# Altium project SPE_router.PrjPcb (part 2 of 3)

## Sheet SPE_router_eth.SchDoc: SPE Router
size 420 x 297 mm; Author: P. Daniel; CompanyName: WUT ISE; DrawnBy: P. Daniel; Organization: WUT ISE; Address1: WUT ISE; Address2: Nowowiejska 15/19 00-665 Warsaw; Address3: piotrmaciejdaniel@gmail.com; Revision: 1; SheetNumber: 3; SheetTotal: 4; ModifiedBy: -; CreateDate: 02-03.2023; CheckedDate: -; Title2: ETH PHY; DivGrp: WUT ISE; Designer: Piotr Daniel
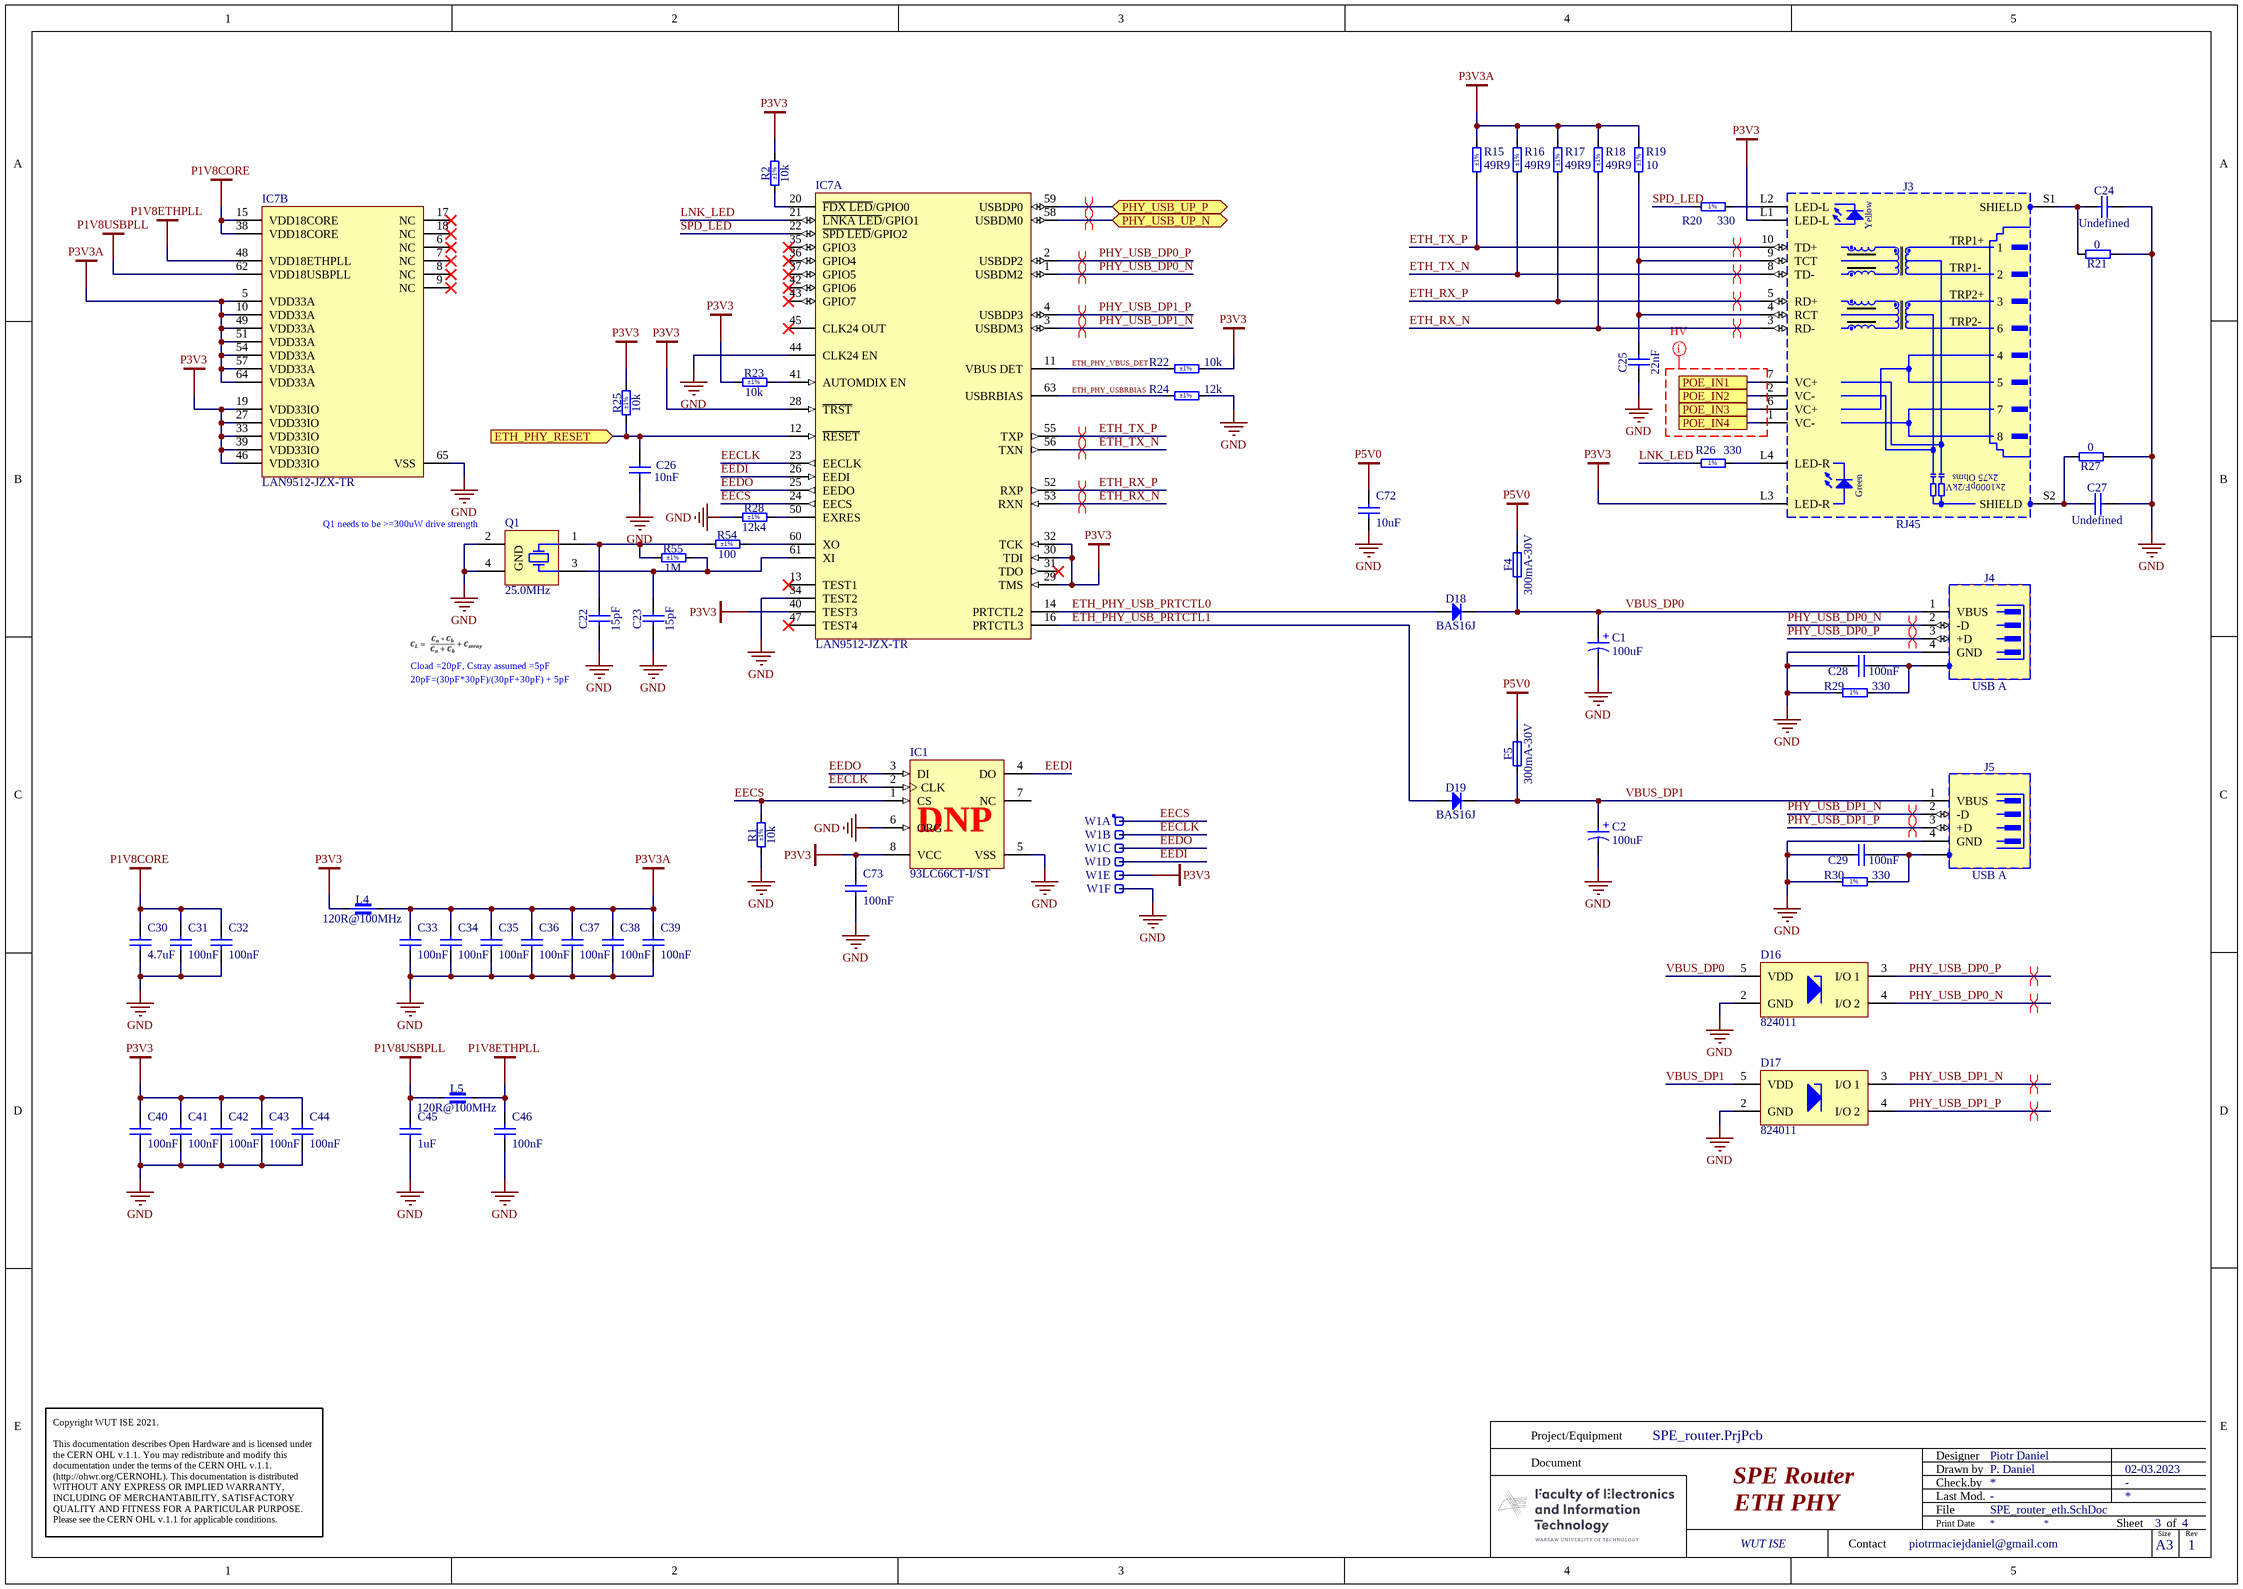
[diagram p2: SPE_router_eth.SchDoc]

### Parts
C1  100uF  [WCAP-ASLU_D5H5.5]
C2  100uF  [WCAP-ASLU_D5H5.5]
C22  15pF  [CAPC1005X55N]
C23  15pF  [CAPC1005X55N]
C24  Undefined  [CAPC2012X135N]
C25  22nF  [CAPC2012X145N]
C26  10nF  [CAPC1005X55N]
C27  Undefined  [CAPC2012X135N]
C28  100nF  [CAPC1005X55N]
C29  100nF  [CAPC1005X55N]
C30  4.7uF  [CAPC1709X95N]
C31  100nF  [CAPC1005X55N]
C32  100nF  [CAPC1005X55N]
C33  100nF  [CAPC1005X55N]
C34  100nF  [CAPC1005X55N]
C35  100nF  [CAPC1005X55N]
C36  100nF  [CAPC1005X55N]
C37  100nF  [CAPC1005X55N]
C38  100nF  [CAPC1005X55N]
C39  100nF  [CAPC1005X55N]
C40  100nF  [CAPC1005X55N]
C41  100nF  [CAPC1005X55N]
C42  100nF  [CAPC1005X55N]
C43  100nF  [CAPC1005X55N]
C44  100nF  [CAPC1005X55N]
C45  1uF  [CAPC1005X55N]
C46  100nF  [CAPC1005X55N]
C72  10uF  [CAPC3216X180N]
C73  100nF  [CAPC1005X55N]
D16  824011  [WE-TVS_SOT23-5L]
D17  824011  [WE-TVS_SOT23-5L]
D18  BAS16J  [SODFL2513X80N]
D19  BAS16J  [SODFL2513X80N]
F4  300mA-30V  [FUSR_BOURNS_MF-MSMF_STYLE1(H110)]
F5  300mA-30V  [FUSR_BOURNS_MF-MSMF_STYLE1(H110)]
IC1  93LC66CT-I/ST  [TSSOP-ST8_M]  (no BOM)
IC7  LAN9512-JZX-TR  [FP-LAN9512-JZX-TR-IPC_B]  (parts A,B of 2)
J3  RJ45  [ABRACON_ARJM11C7-114-BA-EW2]
J4  USB A  [AMPHENOL_73725-0110]
J5  USB A  [AMPHENOL_73725-0110]
L4  120R@100MHz  [INDC1608X95N]
L5  120R@100MHz  [INDC1608X95N]
Q1  25.0MHz  [XTAL_KYOCERA_CX3225SB]
R1  10k  Tolerance: ±1%  [RESC1005X40N]
R2  10k  Tolerance: ±1%  [RESC1005X40N]
R15  49R9  Tolerance: ±1%  [RESC1005X40N]
R16  49R9  Tolerance: ±1%  [RESC1005X40N]
R17  49R9  Tolerance: ±1%  [RESC1005X40N]
R18  49R9  Tolerance: ±1%  [RESC1005X40N]
R19  10  Tolerance: ±1%  [RESC1005X40N]
R20  330  [RESC1005X40N]
R21  0  [RESC1608X55N]
R22  10k  Tolerance: ±1%  [RESC1005X40N]
R23  10k  Tolerance: ±1%  [RESC1005X40N]
R24  12k  Tolerance: ±1%  [RESC1005X40N]
R25  10k  Tolerance: ±1%  [RESC1005X40N]
R26  330  [RESC1005X40N]
R27  0  [RESC1608X55N]
R28  12k4  Tolerance: ±1%  [RESC1005X40N]
R29  330  [RESC1005X40N]
R30  330  [RESC1005X40N]
R54  100  Tolerance: ±1%  [RESC1005X40N]
R55  1M  Tolerance: ±1%  [RESC1005X40N]
W1  Header 6  [SAMTEC_TSW-106-23-L-S]  (value not drawn)  (parts A,B,C,D,E,F of 6)

### Ports
ETH_PHY_RESET (in), PHY_USB_UP_N (bidir), PHY_USB_UP_P (bidir), POE_IN1, POE_IN2, POE_IN3, POE_IN4

### Nets
GND: C1.2(N) C2.2(N) C22.1 C23.1 C24.2 C25.1 C26.1 C27.2 C28.1 C29.1 C30.1 C31.1 C32.1 C33.1 C34.1 C35.1 C36.1 C37.1 C38.1 C39.1 C40.1 C41.1 C42.1 C43.1 C44.1 C45.1 C46.1 C72.1 C73.1 D16.2(GND) D17.2(GND) IC1.5(VSS) IC1.6(ORG) IC7.34(TEST2) IC7.44(CLK24_EN) IC7.65(VSS) J4.4(GND) J5.4(GND) Q1.2(GND) Q1.4(GND) R1.1 R21.1 R24.2 R27.1 R28.1 R29.1 R30.1 W1.6
P1V8CORE: C30.2 C31.2 C32.2 IC7.15(VDD18CORE) IC7.38(VDD18CORE)
P1V8ETHPLL: C46.2 IC7.48(VDD18ETHPLL) L5.2
P1V8USBPLL: C45.2 IC7.62(VDD18USBPLL) L5.1
P3V3: C40.2 C41.2 C42.2 C43.2 C44.2 C73.2 IC1.8(VCC) IC7.19(VDD33IO) IC7.27(VDD33IO) IC7.28(~{TRST}) IC7.29(TMS) IC7.30(TDI) IC7.32(TCK) IC7.33(VDD33IO) IC7.39(VDD33IO) IC7.40(TEST3) IC7.46(VDD33IO) J3.L1(LED-L) J3.L3(LED-R) L4.1 R2.2 R22.2 R23.1 R25.2 W1.5
P3V3A: C33.2 C34.2 C35.2 C36.2 C37.2 C38.2 C39.2 IC7.5(VDD33A) IC7.10(VDD33A) IC7.49(VDD33A) IC7.51(VDD33A) IC7.54(VDD33A) IC7.57(VDD33A) IC7.64(VDD33A) L4.2 R15.2 R16.2 R17.2 R18.2 R19.2
P5V0: C72.2 F4.2 F5.2
EECLK: IC1.2(CLK) IC7.23(EECLK) W1.2
EECS: IC1.1(CS) IC7.24(EECS) R1.2 W1.1
EEDI: IC1.4(DO) IC7.26(EEDI) W1.4
EEDO: IC1.3(DI) IC7.25(EEDO) W1.3
ETH_PHY_RESET: C26.2 IC7.12(~{RESET}) R25.1 ; port ETH_PHY_RESET
ETH_PHY_USB_PRTCTL0: D18.2(A) IC7.14(PRTCTL2)
ETH_PHY_USB_PRTCTL1: D19.2(A) IC7.16(PRTCTL3)
ETH_PHY_USBRBIAS: IC7.63(USBRBIAS) R24.1
ETH_PHY_VBUS_DET: IC7.11(VBUS_DET) R22.1
ETH_RX_N: IC7.53(RXN) J3.3(RD-) R18.1
ETH_RX_P: IC7.52(RXP) J3.5(RD+) R17.1
ETH_TX_N: IC7.56(TXN) J3.8(TD-) R16.1
ETH_TX_P: IC7.55(TXP) J3.10(TD+) R15.1
LNK_LED: IC7.21(~{LNKA_LED}/GPIO1) R26.1
PHY_USB_DP0_N: D16.4(I/O_2) IC7.1(USBDM2) J4.2(-D)
PHY_USB_DP0_P: D16.3(I/O_1) IC7.2(USBDP2) J4.3(+D)
PHY_USB_DP1_N: D17.3(I/O_1) IC7.3(USBDM3) J5.2(-D)
PHY_USB_DP1_P: D17.4(I/O_2) IC7.4(USBDP3) J5.3(+D)
PHY_USB_UP_N: IC7.58(USBDM0) ; port PHY_USB_UP_N
PHY_USB_UP_P: IC7.59(USBDP0) ; port PHY_USB_UP_P
POE_IN1: J3.7(VC+) ; port POE_IN1
POE_IN2: J3.2(VC-) ; port POE_IN2
POE_IN3: J3.6(VC+) ; port POE_IN3
POE_IN4: J3.1(VC-) ; port POE_IN4
SPD_LED: IC7.22(~{SPD_LED}/GPIO2) R20.1
VBUS_DP0: C1.1(P) D16.5(VDD) D18.1(C) F4.1 J4.1(VBUS)
VBUS_DP1: C2.1(P) D17.5(VDD) D19.1(C) F5.1 J5.1(VBUS)
NetC22_2: C22.2 Q1.1(X) R54.1 R55.1
NetC23_2: C23.2 IC7.61(XI) Q1.3(X) R55.2
NetC24_1: C24.1 J3.S1(SHIELD) R21.2
NetC25_2: C25.2 J3.4(RCT) J3.9(TCT) R19.1
NetC27_1: C27.1 J3.S2(SHIELD) R27.2
NetC28_2: C28.2 J4.5(SHIELD) R29.2
NetC29_2: C29.2 J5.5(SHIELD) R30.2
NetIC7_20: IC7.20(~{FDX_LED}/GPIO0) R2.1
NetIC7_41: IC7.41(AUTOMDIX_EN) R23.2
NetIC7_50: IC7.50(EXRES) R28.2
NetIC7_60: IC7.60(XO) R54.2
NetJ3_L2: J3.L2(LED-L) R20.2
NetJ3_L4: J3.L4(LED-R) R26.2

Not connected (* = marked no-connect by the designer): IC1 7(NC); IC7 6(NC)* 7(NC)* 8(NC)* 9(NC)* 13(TEST1)* 17(NC)* 18(NC)* 31(TDO)* 35(GPIO3)* 36(GPIO4)* 37(GPIO5)* 42(GPIO6)* 43(GPIO7)* 45(CLK24_OUT)* 47(TEST4)*

### Layout directives
net class HV: (no net found under the mark)
differential pair: ETH_RX_N, ETH_RX_P, ETH_TX_N, ETH_TX_P, PHY_USB_DP0_N, PHY_USB_DP0_P, PHY_USB_DP1_N, PHY_USB_DP1_P, PHY_USB_UP_N, PHY_USB_UP_P

### Notes on the sheet
- (near Q1) Q1 needs to be >=300uW drive strength
- (near C22) Cload =20pF, Cstray assumed =5pF
- 20pF=(30pF*30pF)/(30pF+30pF) + 5pF
- (near IC1) DNP
- Project/Equipment
- Document
- Designer
- Drawn by
- Check.by
- Copyright WUT ISE 2021.
  This documentation describes Open Hardware and is licensed under the CERN OHL v.1.1. You may redistribute and modify this documentation under the terms of the CERN OHL v.1.1. (http://ohwr.org/CERNOHL). This documentation is distributed WITHOUT ANY EXPRESS OR IMPLIED WARRANTY, INCLUDING OF MERCHANTABILITY, SATISFACTORY QUALITY AND FITNESS FOR A PARTICULAR PURPOSE. Please see the CERN OHL v.1.1 for applicable conditions.
- Contact
- File
- Last Mod.
- Print Date
- Sheet
- Size
- A3
- of
- Rev
- (in symbol CMP-03913-54202508-1) +
- (in symbol CON_ETH_POE_ARJM11C7) Yellow; TRP1+; TRP1-; TRP2+; TRP2-; 2x75 Ohms; Green; 2x1000pF/2kV
- (in symbol R0402_330R_1%_0.0625W_100PPM) 1%

### Library data of the parts
C1 C2 = CMP-03913-54202508-1: 865090142005 Electrolytic capacitor; SMD; 100uF; 6.3V; 20%; 85deg.C; 5.0x5.5; Manufacturer: Wurth Elektronik; Capacitance: 100µF; Life (Hours): 1000hours; Polarity: Polar; Ripple Current: 70mA; Insulation Resistance: 1MΩ; Leakage Current: 1.3µA; Tolerance: 20%; Case/Package: Radial; Length: 5.5mm; NexarPartId: 54202508; Width: 5.3mm; Height - Seated (Max): 5.5118mm; Voltage Rating: 6.3V; Height: 5.5mm; RoHS: Compliant; Ripple Current (AC): 70mA; Min Operating Temperature: -40°C; REACH SVHC: Unknown; Voltage Rating (DC): 6.3V; Max Operating Temperature: 85°C; Packaging: Cut Tape (CT); Mount: Surface Mount; Diameter: 5mm; Manufacturer Part Number: 865090142005
C22 C23 = CC0402_15PF_50V_5%_C0G: Non-polarised capacitor; Part Description: SMD Multilayer Chip Ceramic Capacitor; Manufacturer: GENERIC; Manufacturer1 Part Number: C0402C150J5GACTU; Voltage: 50V; TC: C0G/NP0; Tolerance: ±5%; Part Number: CC0402_15PF_50V_5%_C0G; Component Kind: Standard; Component Type: Standard; Pin Count: 2; Value: 15pF; Status: Preferred; Manufacturer Part Number: CC0402_15PF_50V_5%_C0G; Case: 0402; Mounted: Yes; Socket: No; SMD: Yes; Sense: No; Manufacturer1 Example: KEMET; Manufacturer1 ComponentHeight: 0.55mm; HelpURL: \\cern.ch\dfs\Applications\Altium\Datasheets\CC0402_C0G_KEMET_(Commercial Grade).pdf; Author: CERN DEM JLC; CreateDate: 03.12.2007; LatestRevisionDate: 22.04.2015
C24 C27 = CC0805_NO-VALUE: Non-polarised capacitor; Part Description: Reserved Footprint For 0805(2012) Chip Ceramic Capacitor; Mounted: No; Part Number: CC0805_NO-VALUE; Component Kind: Standard; Component Type: Standard; Pin Count: 2; Value: Undefined; Status: None; Manufacturer: Undefined; Manufacturer Part Number: CC0805_NO-VALUE; Case: 0805; Socket: No; SMD: Yes; Sense: No; Manufacturer1 ComponentHeight: 1.35mm; HelpURL: Undefined; Author: CERN DEM JLC; CreateDate: 10.12.2008; LatestRevisionDate: 11.09.2013
C25 = CC0805_22NF_50V_10%_X7R_YUDEN_UMJ212BB7223KGHT: Non-polarised capacitor; Part Description: SMD Multilayer Chip Ceramic Capacitor for Automotive / Industrial Applications; Manufacturer: TAIYO YUDEN; Voltage: 50V; TC: X7R; Tolerance: ±10%; Part Number: CC0805_22NF_50V_10%_X7R_YUDEN_UMJ212BB7223KGHT; Component Kind: Standard; Component Type: Standard; Pin Count: 2; Value: 22nF; Status: Not Recommended; Manufacturer Part Number: UMJ212BB7223KGHT; Case: 0805; Mounted: Yes; Socket: No; SMD: Yes; Sense: No; ComponentHeight: 1.45mm; HelpURL: \\cern.ch\dfs\Applications\Altium\Datasheets\CC0805_TAIYO-YUDEN_UMJ212BB7223KGHT.pdf; Author: CERN DEM JLC; CreateDate: 23.01.2018; LatestRevisionDate: 23.01.2018
C26 = CC0402_10NF_16V_10%_X7R: Non-polarised capacitor; Part Description: SMD Multilayer Chip Ceramic Capacitor; Manufacturer: GENERIC; Manufacturer1 Part Number: 223878715636; Voltage: 16V; TC: X7R; Tolerance: ±10%; Part Number: CC0402_10NF_16V_10%_X7R; Component Kind: Standard; Component Type: Standard; Pin Count: 2; Value: 10nF; Status: Not Recommended; Manufacturer Part Number: CC0402_10NF_16V_10%_X7R; Case: 0402; Mounted: Yes; Socket: No; SMD: Yes; Sense: No; Manufacturer1 Example: PHYCOMP; Manufacturer1 ComponentHeight: 0.55mm; HelpURL: \\cern.ch\dfs\Applications\Altium\Datasheets\CC0402_X7R_PHYCOMP.pdf; Author: CERN DEM JLC; CreateDate: 03.12.2007; LatestRevisionDate: 03.12.2007
C28 C29 C31-C44 C46 C73 = CC0402_100NF_16V_10%_X7R: Non-polarised capacitor; Part Description: SMD Multilayer Chip Ceramic Capacitor; Manufacturer: GENERIC; Manufacturer1 Part Number: GRM155R71C104KA88D; Voltage: 16V; TC: X7R; Tolerance: ±10%; Part Number: CC0402_100NF_16V_10%_X7R; Component Kind: Standard; Component Type: Standard; Pin Count: 2; Value: 100nF; Status: Not Recommended; Manufacturer Part Number: CC0402_100NF_16V_10%_X7R; Case: 0402; Mounted: Yes; Socket: No; SMD: Yes; Sense: No; Manufacturer1 Example: MURATA; Manufacturer1 ComponentHeight: 0.55mm; HelpURL: \\cern.ch\dfs\Applications\Altium\Datasheets\CC0402_X7R_MURATA_GRM.pdf; Author: CERN DEM JLC; CreateDate: 05.12.2013; LatestRevisionDate: 03.12.2007
C30 = CC0603_4.7UF_16V_10%_X5R: Non-polarised capacitor; Part Description: SMD Multilayer Chip Ceramic Capacitor; Manufacturer: GENERIC; Manufacturer1 Part Number: EMK107ABJ475KA-T; Voltage: 16V; TC: X5R; Tolerance: ±10%; Part Number: CC0603_4.7UF_16V_10%_X5R; Component Kind: Standard; Component Type: Standard; Pin Count: 2; Value: 4.7uF; Status: None; Manufacturer Part Number: CC0603_4.7UF_16V_10%_X5R; Case: 0603; Mounted: Yes; Socket: No; SMD: Yes; Sense: No; Manufacturer1 Example: TAIYO YUDEN; Manufacturer1 ComponentHeight: 0.95mm; HelpURL: \\cern.ch\dfs\Applications\Altium\Datasheets\CC0603_X7R_TAIYO-YUDEN_HIGH-VALUE.pdf; Author: CERN DEM JLC; CreateDate: 16.12.2013; LatestRevisionDate: 16.09.2014
C45 = CC0402_1UF_16V_10%_X5R: Non-polarised capacitor; Part Description: SMD Multilayer Chip Ceramic Capacitor; Manufacturer: GENERIC; Manufacturer1 Part Number: C1005X5R1C105KT; Voltage: 16V; TC: X5R; Tolerance: ±10%; Part Number: CC0402_1UF_16V_10%_X5R; Component Kind: Standard; Component Type: Standard; Pin Count: 2; Value: 1uF; Status: Preferred; Manufacturer Part Number: CC0402_1UF_16V_10%_X5R; Case: 0402; Mounted: Yes; Socket: No; SMD: Yes; Sense: No; Manufacturer1 Example: TDK; Manufacturer1 ComponentHeight: 0.55mm; HelpURL: \\cern.ch\dfs\Applications\Altium\Datasheets\CC0402_X5R_TDK_C.pdf; Author: CERN DEM JLC; CreateDate: 25.10.2012; LatestRevisionDate: 25.10.2012
C72 = CC1206_10UF_25V_10%_X7R: Non-polarised capacitor; Part Description: SMD Multilayer Chip Ceramic Capacitor; Manufacturer: GENERIC; Manufacturer1 Part Number: C1206C106K4RACTU; Voltage: 25V; TC: X7R; Tolerance: ±10%; Part Number: CC1206_10UF_25V_10%_X7R; Component Kind: Standard; Component Type: Standard; Pin Count: 2; Value: 10uF; Status: Preferred; Manufacturer Part Number: CC1206_10UF_25V_10%_X7R; Case: 1206; Mounted: Yes; Socket: No; SMD: Yes; Sense: No; Manufacturer1 Example: KEMET; Manufacturer1 ComponentHeight: 1.8mm; HelpURL: \\cern.ch\dfs\Applications\Altium\Datasheets\CC1206_X7R_KEMET.pdf; Author: CERN DEM JLC; CreateDate: 12.09.2012; LatestRevisionDate: 12.09.2012
D16 D17 = CMP-1474-00002-2: NexarPartId: 11914007; Polarity: Bidirectional; Min Breakdown Voltage: 6.1V; Max Surge Current: 12A; Direction: Unidirectional; Reverse Standoff Voltage: 5V; Clamping Voltage: 8.5V; Operating Supply Voltage: 6V; Capacitance: 2pF; Number of Channels: 2; ESD Protection: Yes; Forward Voltage: 700mV; Test Current: 1mA; Leakage Current: 5µA; Max Reverse Leakage Current: 5A; Min Operating Temperature: -55°C; Case/Package: SOT-23; Mount: Surface Mount; Max Breakdown Voltage: 6.1V; Length: 2.9mm; Height: 1.16mm; Working Voltage: 5V; Termination: SMD/SMT; Breakdown Voltage: 6.1V; Number of Bidirectional Channels: 2; RoHS: Compliant; Packaging: Digi-Reel®; Number of Pins: 5; Power Line Protection: Yes; Peak Pulse Current: 12A; Max Operating Temperature: 125°C; Width: 2.8mm; REACH SVHC: Unknown
D18 D19 = BAS16J: Diode; Part Description: High-speed switching diode; Manufacturer: NEXPERIA; Voltage: 100V; Power: 250mA; PressFit: No; Bonding: No; Part Number: BAS16J; Component Kind: Standard; Component Type: Standard; Device: BAS16J; PackageDescription: SODFL Diode (SOD323F); 1.70mm W X 1.25mm L X 0.80mm H body, IPC Medium Density; Manufacturer Part Number: BAS16J; Pin Count: 2; Case: SOD-323F; Mounted: Yes; Socket: No; SMD: Yes; Sense: No; ComponentHeight: 0.8mm; HelpURL: \\cern.ch\dfs\Applications\Altium\Datasheets\BAS16J.pdf; Author: CERN DEM BC; CreateDate: 19.12.2019; LatestRevisionDate: 19.12.2019
F4 F5 = FUSR_BOURNS_MF-MSMF030-2: Fuse; Part Description: PTC Resettable Fuse; Manufacturer: BOURNS; PressFit: No; Part Number: FUSR_BOURNS_MF-MSMF030-2; Component Kind: Standard; Component Type: Standard; Pin Count: 2; PackageDescription: PTC Resettable Fuse, MF-MSMS Series, Case Style 1 Height 1.10mm; Family: Fuses Resettable; Mounted: Yes; Socket: No; SMD: Yes; Sense: No; Value: 300mA-30V; Manufacturer Part Number: MF-MSMF030-2; ComponentHeight: 1.1mm; HelpURL: \\cern.ch\dfs\Applications\Altium\Datasheets\FUSR_BOURNS_MF-MSMF.pdf; Author: CERN DEM JLC; CreateDate: 22.01.2013; LatestRevisionDate: 22.01.2013
IC1 = CMP-0162-00555-1: 4K, 512x8 or 256x16-bit, 2.5V Microwire Serial EEPROM, 8-Pin TSSOP, Industrial Temperature, Tape and Reel; PackageDescription: 8-Lead Plastic Thin Shrink Small Outline (ST) - 4.4mm Body [TSSOP]; DatasheetVersion: revD, May-2008; PackageReference: TSSOP-ST8; Code_JEDEC: MO-153; PackageVersion: revBB, Aug-2009
IC7 = LAN9512-JZX-TR: USB 2.0 to 10/100 Ethernet Controllers with 2-port USB2.0 Hub, 64 QFN 9x9x0.9mm; Manufacturer: Microchip; Operating Supply Voltage: 3.3V; Data Rate: 480Mbps; Operating Supply Current: 231mA; Max Power Dissipation: 763mW; Number of Ports: 2; Supplier 1: Mouser; Manufacturer Part Number: LAN9512-JZX-TR; RoHS: Yes; Category: Ethernet Interface ICs; Stock 1: 5518; Pricing 1: 1=6,53000, 10=6,53000, 50=5,95000, 100=5,95000, 1000=5,95000, 10000=5,95000 (USD); Mount: Surface Mount; Case/Package: QFN; Number of Pins: 64; Min Operating Temperature: 0°C; Max Operating Temperature: 70°C; Packaging: Tape and Reel; Package Quantity: 3000; Interface: USB; Radiation Hardening: No; RoHS Compliant: Yes; ComponentLink1URL: https://datasheet.ciiva.com/29644/9512-29644800.pdf?src-supplier=Digi-Key; ComponentLink1Description: https://datasheet.ciiva.com/29644/9512-29644800.pdf?src-supplier=Digi-Key; ComponentLink2URL: https://datasheet.ciiva.com/29897/9512-29897990.pdf?src-supplier=Avnet; ComponentLink2Description: https://datasheet.ciiva.com/29897/9512-29897990.pdf?src-supplier=Avnet; Supplier Part Number 1: 579-LAN9512-JZX-TR
J3 = CON_ETH_POE_ARJM11C7: MagJack 10/100BaseT, PoE+, 1X1, OG/Y, -40 to 85*C, Tab Up, RoHS; Part Number: ARJM11C7-114-BA-EW2; Part Description: 1 Port, Orange Green/Yellow LEDs, RJ45 10/100BaseT, PoE, Ethernet MagJack® Connector Module; Manufacturer: Abracon; PressFit: No; Component Kind: Standard; Component Type: Standard; Pin Count: 18; Family: RJ45; Mounted: Yes; Socket: No; SMD: No; Sense: No; Status: None; Manufacturer Part Number: ARJM11C7-114-BA-EW2; ComponentHeight: 13.61mm; HelpURL: \\cern.ch\dfs\Applications\Altium\Datasheets\BELFUSE_0826-1X1T-GJ-F.pdf; Author: GK; CreateDate: 05.11.2012; LatestRevisionDate: 05.11.2012
J4 J5 = AMPHENOL_73725-0110BLF: 4 Pin + 1 Shield USB Receptacle; Part Description: Right Angle, Up right, Receptacle USB 2.0, Type A, Through Hole; PressFit: No; Part Number: AMPHENOL_73725-0110BLF; Component Kind: Standard; Component Type: Standard; Pin Count: 8; Family: USB A; Mounted: Yes; Socket: No; SMD: No; Sense: No; Status: None; Manufacturer: AMPHENOL; Manufacturer Part Number: 73725-0110BLF; ComponentHeight: 13.83mm; HelpURL: \\cern.ch\dfs\Applications\Altium\Datasheets\AMPHENOL_73725-0110BLF.pdf; Author: CERN DEM BC; CreateDate: 20.11.2020; LatestRevisionDate: 20.11.2020
L4 L5 = IND0603_MURATA_BLM18PG121SN1D: Part Description: SMD EMIFIL Chip Ferrite Bead; Manufacturer: MURATA; Power: 2A; Resistance: 0.05R; Part Number: IND0603_MURATA_BLM18PG121SN1D; Component Kind: Standard; Component Type: Standard; Pin Count: 2; Value: 120R@100MHz; Manufacturer Part Number: BLM18PG121SN1D; Case: 0603; Mounted: Yes; Socket: No; SMD: Yes; Sense: No; ComponentHeight: 0.95mm; HelpURL: \\cern.ch\dfs\Applications\Altium\Datasheets\IND0603_MURATA_BLM18P.pdf; Author: CERN DEM BC; CreateDate: 27.07.2015; LatestRevisionDate: 25.10.2018
Q1 = ECS-250-12-33B-CWY-TR3: Crystal 25 Mhz 12PF SMD; Manufacturer: ECS International; Supplier 1: Digikey; Manufacturer Part Number: ECS-250-12-33B-CWY-TR3; RoHS: No; Category: Uncategorized; Stock 1: 1965; Pricing 1: 1=0,45, 10=0,376, 50=0,3386, 100=0,301, 500=0,28594, 1000=0,24078 (USD); Supplier Part Number 1: 50-ECS-250-12-33B-CWY-TR3CT-ND; Value: 25.0MHz
R1 R2 R22 R23 R25 = R0402_10K_1%_0.0625W_100PPM: Resistor - 1%; Part Description: General Purpose Thick Film Chip Resistor; Manufacturer: GENERIC; Manufacturer1 Part Number: 232270671003L; TC: ±100ppm/°C; PressFit: No; Part Number: R0402_10K_1%_0.0625W_100PPM; Component Kind: Standard; Component Type: Standard; Pin Count: 2; Value: 10k; Status: Not Recommended; Power: 0.0625W; Manufacturer Part Number: R0402_10K_1%_0.0625W_100PPM; Case: 0402; Mounted: Yes; Sense: No; Socket: No; SMD: Yes; Manufacturer1 Example: YAGEO PHYCOMP; Manufacturer1 ComponentHeight: 0.4mm; HelpURL: \\cern.ch\dfs\Applications\Altium\Datasheets\R0402_Phycomp_RC0402.pdf; Author: CERN DEM JLC; CreateDate: 03.12.2007; LatestRevisionDate: 17.10.2012
R15-R18 = R0402_49R9_1%_0.0625W_100PPM: Resistor - 1%; Part Description: General Purpose Thick Film Chip Resistor; Manufacturer: GENERIC; Manufacturer1 Part Number: 232270674999L or RC0402FR-0749R9L; TC: ±100ppm/°C; PressFit: No; Part Number: R0402_49R9_1%_0.0625W_100PPM; Component Kind: Standard; Component Type: Standard; Pin Count: 2; Value: 49R9; Status: Not Recommended; Power: 0.0625W; Manufacturer Part Number: R0402_49R9_1%_0.0625W_100PPM; Case: 0402; Mounted: Yes; Sense: No; Socket: No; SMD: Yes; Manufacturer1 Example: YAGEO PHYCOMP; Manufacturer1 ComponentHeight: 0.4mm; HelpURL: \\cern.ch\dfs\Applications\Altium\Datasheets\R0402_Phycomp_RC0402.pdf; Author: CERN DEM JLC; CreateDate: 24.10.2012; LatestRevisionDate: 24.10.2012
R19 = R0402_10R_1%_0.0625W_200PPM: Resistor - 1%; Part Description: General Purpose Thick Film Chip Resistor; Manufacturer: GENERIC; Manufacturer1 Part Number: 232270671009L; TC: ±200ppm/°C; PressFit: No; Part Number: R0402_10R_1%_0.0625W_200PPM; Component Kind: Standard; Component Type: Standard; Pin Count: 2; Value: 10; Status: Not Recommended; Power: 0.0625W; Manufacturer Part Number: R0402_10R_1%_0.0625W_200PPM; Case: 0402; Mounted: Yes; Sense: No; Socket: No; SMD: Yes; Manufacturer1 Example: YAGEO PHYCOMP; Manufacturer1 ComponentHeight: 0.4mm; HelpURL: \\cern.ch\dfs\Applications\Altium\Datasheets\R0402_Phycomp_RC0402.pdf; Author: CERN DEM JLC; CreateDate: 24.06.2009; LatestRevisionDate: 17.10.2012
R20 R26 R29 R30 = R0402_330R_1%_0.0625W_100PPM: Resistor - 1%; Part Description: General Purpose Thick Film Chip Resistor; Manufacturer: GENERIC; Manufacturer1 Part Number: 232270673301L; TC: ±100ppm/°C; PressFit: No; Part Number: R0402_330R_1%_0.0625W_100PPM; Component Kind: Standard; Component Type: Standard; Pin Count: 2; Value: 330; Status: Not Recommended; Power: 0.0625W; Tolerance: ±1%; Manufacturer Part Number: R0402_330R_1%_0.0625W_100PPM; Case: 0402; Mounted: Yes; Sense: No; Socket: No; SMD: Yes; Manufacturer1 Example: YAGEO PHYCOMP; Manufacturer1 ComponentHeight: 0.4mm; HelpURL: \\cern.ch\dfs\Applications\Altium\Datasheets\R0402_Phycomp_RC0402.pdf; Author: CERN DEM JLC; CreateDate: 03.12.2007; LatestRevisionDate: 17.10.2012
R21 R27 = R0603_0R_JUMPER: Resistor; Part Description: 1A (0.05R Max DC Resistance) Zero Ohm Jumper; Manufacturer: GENERIC; Manufacturer1 Part Number: NRC06Z0; PressFit: No; Part Number: R0603_0R_JUMPER; Component Kind: Standard; Component Type: Standard; Pin Count: 2; Value: 0; Status: Preferred; Manufacturer Part Number: R0603_0R_JUMPER; Case: 0603; Mounted: Yes; Sense: No; Socket: No; SMD: Yes; Manufacturer1 Example: NIC COMPONENT; Manufacturer1 ComponentHeight: 0.55mm; HelpURL: \\cern.ch\dfs\Applications\Altium\Datasheets\R0603_NIC_NRC.pdf; Author: CERN DEM JLC; CreateDate: 03.12.2007; LatestRevisionDate: 13.03.2008
R24 = R0402_12K_1%_0.0625W_100PPM: Resistor - 1%; Part Description: General Purpose Thick Film Chip Resistor; Manufacturer: GENERIC; Manufacturer1 Part Number: 232270671203L; TC: ±100ppm/°C; PressFit: No; Part Number: R0402_12K_1%_0.0625W_100PPM; Component Kind: Standard; Component Type: Standard; Pin Count: 2; Value: 12k; Status: Not Recommended; Power: 0.0625W; Manufacturer Part Number: R0402_12K_1%_0.0625W_100PPM; Case: 0402; Mounted: Yes; Sense: No; Socket: No; SMD: Yes; Manufacturer1 Example: YAGEO PHYCOMP; Manufacturer1 ComponentHeight: 0.4mm; HelpURL: \\cern.ch\dfs\Applications\Altium\Datasheets\R0402_Phycomp_RC0402.pdf; Author: CERN DEM JLC; CreateDate: 03.12.2007; LatestRevisionDate: 17.10.2012
R28 = R0402_12K4_1%_0.0625W_100PPM: Resistor - 1%; Part Description: General Purpose Thick Film Chip Resistor; Manufacturer: GENERIC; Manufacturer1 Part Number: RC0402FR-0712K4L; TC: ±100ppm/°C; PressFit: No; Part Number: R0402_12K4_1%_0.0625W_100PPM; Component Kind: Standard; Component Type: Standard; Pin Count: 2; Value: 12k4; Status: Preferred; Power: 0.0625W; Manufacturer Part Number: R0402_12K4_1%_0.0625W_100PPM; Case: 0402; Mounted: Yes; Sense: No; Socket: No; SMD: Yes; Manufacturer1 Example: YAGEO PHYCOMP; Manufacturer1 ComponentHeight: 0.4mm; HelpURL: \\cern.ch\dfs\Applications\Altium\Datasheets\R0402_YAGEO_RC_L.pdf; Author: CERN DEM BC; CreateDate: 01.12.2020; LatestRevisionDate: 01.12.2020
R54 = R0402_100R_1%_0.0625W_100PPM: Resistor - 1%; Part Description: General Purpose Thick Film Chip Resistor; Manufacturer: GENERIC; Manufacturer1 Part Number: 232270671001L; PressFit: No; TC: ±100ppm/°C; Part Number: R0402_100R_1%_0.0625W_100PPM; Component Kind: Standard; Component Type: Standard; Pin Count: 2; Value: 100; Status: Not Recommended; Manufacturer Part Number: R0402_100R_1%_0.0625W_100PPM; Case: 0402; Mounted: Yes; Sense: No; Socket: No; SMD: Yes; Manufacturer1 Example: YAGEO PHYCOMP; Manufacturer1 ComponentHeight: 0.4mm; HelpURL: \\cern.ch\dfs\Applications\Altium\Datasheets\R0402_Phycomp_RC0402.pdf; Author: CERN DEM JLC; CreateDate: 03.12.2007; LatestRevisionDate: 17.10.2012; Power: 0.0625W
R55 = R0402_1M_1%_0.0625W_100PPM: Resistor - 1%; Part Description: General Purpose Thick Film Chip Resistor; Manufacturer: GENERIC; Manufacturer1 Part Number: 232270671005L; TC: ±100ppm/°C; PressFit: No; Part Number: R0402_1M_1%_0.0625W_100PPM; Component Kind: Standard; Component Type: Standard; Pin Count: 2; Value: 1M; Status: Not Recommended; Power: 0.0625W; Manufacturer Part Number: R0402_1M_1%_0.0625W_100PPM; Case: 0402; Mounted: Yes; Sense: No; Socket: No; SMD: Yes; Manufacturer1 Example: YAGEO PHYCOMP; Manufacturer1 ComponentHeight: 0.4mm; HelpURL: \\cern.ch\dfs\Applications\Altium\Datasheets\R0402_Phycomp_RC0402.pdf; Author: CERN DEM JLC; CreateDate: 03.12.2007; LatestRevisionDate: 17.10.2012
W1 = SAMTEC_TSW-106-23-L-S: 6 Mini Wire-Wrap Contact Strip Header; Part Description: 6 Contacts, Pitch 2.54mm, Single Row Through Mount Straight Header (Post Lead = 5.84mm, Tail Lead 2.92mm, Insulator 2.54mm); Manufacturer: SAMTEC; PressFit: No; Part Number: SAMTEC_TSW-106-23-L-S; Component Kind: Standard; Component Type: Standard; Pin Count: 6; Family: Header 6; Mounted: Yes; Socket: No; SMD: No; Sense: No; Status: None; Manufacturer Part Number: TSW-106-23-L-S; ComponentHeight: 8.38mm; HelpURL: \\cern.ch\dfs\Applications\Altium\Datasheets\SAMTEC_TSW-106-23-L-S.pdf; Author: CERN DEM BC; CreateDate: 06.03.2017; LatestRevisionDate: 06.03.2017